# EAGLE design sensor-example (EAGLE 9.0.0)
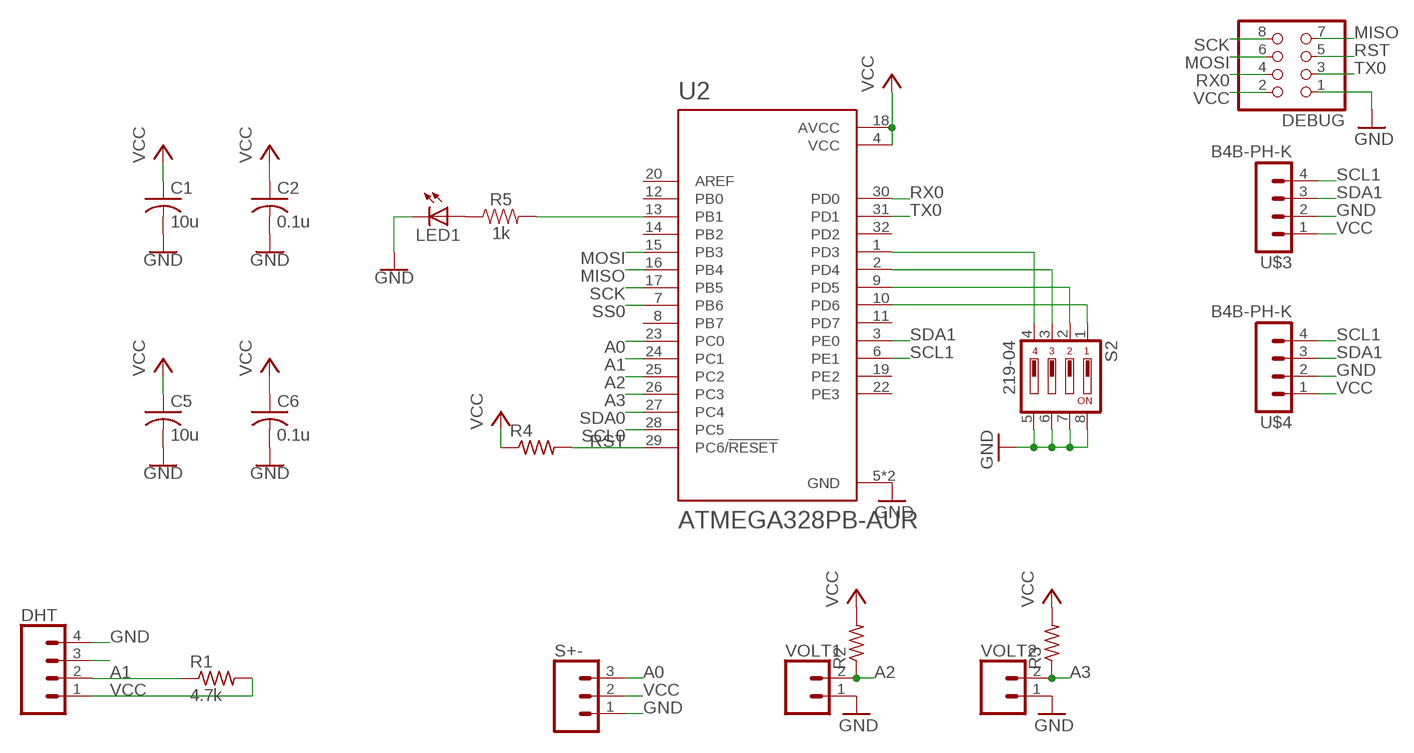
[diagram p0: schematic, sheet 1]

## Parts
C1  10u  C-USC0603  [C0603]
C2  0.1u  C-USC0603  [C0603]
C5  10u  C-USC0603  [C0603]
C6  0.1u  C-USC0603  [C0603]
DEBUG  PINHD-2X4  [2X04]
DHT  CONN_04  [1X04]
LED1  LEDSML0805  [SML0805]
R1  4.7k  R-US_R0603  [R0603]
R2  R-US_R0603  [R0603]
R3  R-US_R0603  [R0603]
R4  R-US_R0603  [R0603]
R5  1k  1KOHM-0603-1/10W-1%  [0603]
S2  219-04  [CTS-219-04]
S+-  CONN_03  [1X03]
U2  ATMEGA328PB-AUR  [QFP80P900X900X120-32N]
U$3  B4B-PH-K  [B4B-PH-K]
U$4  B4B-PH-K  [B4B-PH-K]
VOLT1  CONN_02  [1X02]
VOLT2  CONN_02  [1X02]

## Nets
A0: S+-.3 U2.23(PC0)
A1: DHT.2 R1.1 U2.24(PC1)
A2: R2.1 U2.25(PC2) VOLT1.2
A3: R3.1 U2.26(PC3) VOLT2.2
GND: C1.2 C2.2 DEBUG.1 DHT.4 LED1.C S2.5 S2.6 S2.7 S2.8 S+-.1 U2.5(GND) U2.21(GND) U$3.2 U$4.2 VOLT1.1 VOLT2.1
MISO: DEBUG.7 U2.16(PB4)
MOSI: DEBUG.6 U2.15(PB3)
N$1: S2.4 U2.1(PD3)
N$2: S2.3 U2.2(PD4)
N$3: S2.2 U2.9(PD5)
N$4: S2.1 U2.10(PD6)
N$6: DHT.3
N$12: LED1.A R5.1
N$13: R5.2 U2.13(PB1)
RST: DEBUG.5 R4.2 U2.29(PC6/!RESET)
RX0: DEBUG.4 U2.30(PD0)
SCK: DEBUG.8 U2.17(PB5)
SCL0: U2.28(PC5)
SCL1: U2.6(PE1) U$3.4 U$4.4
SDA0: U2.27(PC4)
SDA1: U2.3(PE0) U$3.3 U$4.3
SS0: U2.7(PB6)
TX0: DEBUG.3 U2.31(PD1)
VCC: C1.1 C2.1 C5.1 C6.1 DEBUG.2 DHT.1 R1.2 R2.2 R3.2 R4.1 S+-.2 U2.4(VCC) U2.18(AVCC) U$3.1 U$4.1
Unconnected: C5.2 C6.2 U2.8(PB7) U2.11(PD7) U2.12(PB0) U2.14(PB2) U2.19(PE2) U2.20(AREF) U2.22(PE3) U2.32(PD2)

## Library data of the parts
C1 C2 C5 C6 = resistor:C-US: CAPACITOR, American symbol
DEBUG = pinhead:PINHD-2X4: PIN HEADER
DHT = SparkFun-Connectors:CONN_04: Multi connection point. Often used as Generic Header-pin footprint for 0.1 inch spaced/style header connections On any of the 0.1 inch spaced packages, you can populate with these: Break Away Headers - Straight <https://www.sparkfun.com/products/116> (PRT-00116) Break Away Male Headers - Right Angle <https://www.sparkfun.com/products/553> (PRT-00553) Female Headers <https://www.sparkfun.com/products/115> (PRT-00115) Break Away Headers - Machine Pin <https://www.sparkfun.com/products/117> (PRT-00117) Break Away Female Headers - Swiss Machine Pin <https://www.sparkfun.com/products/743> (PRT-00743) For SCREWTERMINALS and SPRING TERMINALS visit here: Screw Terimnals on SparkFun.com <https://www.sparkfun.com/search/results?term=Screw+Terminals> (5mm/3.5mm/2.54mm spacing) This device is also useful as a general connection point to wire up your design to another part of your project. Our various solder wires solder well into these plated through hole pads. Hook-Up Wire - Assortment (Stranded, 22 AWG) <https://www.sparkfun.com/products/11375> (PRT-11375) Hook-Up Wire - Assortment (Solid Core, 22 AWG) <https://www.sparkfun.com/products/11367> (PRT-11367) View the entire wire category on our website here <https://www.sparkfun.com/categories/141> Special notes: Molex polarized connector foot print use with SKU : PRT-08231 with associated crimp pins and housings. 1MM SMD Version SKU: PRT-10208; PROD_ID: CONN-09696
LED1 = led:LED: LED OSRAM: - CHIPLED LG R971, LG N971, LY N971, LG Q971, LY Q971, LO R971, LY R971 LH N974, LH R974 LS Q976, LO Q976, LY Q976 LO Q996 - Hyper CHIPLED LW Q18S LB Q993, LB Q99A, LB R99A - SideLED LS A670, LO A670, LY A670, LG A670, LP A670 LB A673, LV A673, LT A673, LW A673 LH A674 LY A675 LS A676, LA A676, LO A676, LY A676, LW A676 LS A679, LY A679, LG A679 - Hyper Micro SIDELED® LS Y876, LA Y876, LO Y876, LY Y876 LT Y87S - SmartLED LW L88C, LW L88S LB L89C, LB L89S, LG L890 LS L89K, LO L89K, LY L89K LS L896, LA L896, LO L896, LY L896 - TOPLED LS T670, LO T670, LY T670, LG T670, LP T670 LSG T670, LSP T670, LSY T670, LOP T670, LYG T670 LG T671, LOG T671, LSG T671 LB T673, LV T673, LT T673, LW T673 LH T674 LS T676, LA T676, LO T676, LY T676, LB T676, LH T676, LSB T676, LW T676 LB T67C, LV T67C, LT T67C, LS T67K, LO T67K, LY T67K, LW E67C LS E67B, LA E67B, LO E67B, LY E67B, LB E67C, LV E67C, LT E67C LW T67C LS T679, LY T679, LG T679 LS T770, LO T770, LY T770, LG T770, LP T770 LB T773, LV T773, LT T773, LW T773 LH T774 LS E675, LA E675, LY E675, LS T675 LS T776, LA T776, LO T776, LY T776, LB T776 LHGB T686 LT T68C, LB T68C - Hyper Mini TOPLED® LB M676 - Mini TOPLED Santana® LG M470 LS M47K, LO M47K, LY M47K Source: http://www.osram.convergy.de LUXEON: - LUMILED® LXK2-PW12-R00, LXK2-PW12-S00, LXK2-PW14-U00, LXK2-PW14-V00 LXK2-PM12-R00, LXK2-PM12-S00, LXK2-PM14-U00 LXK2-PE12-Q00, LXK2-PE12-R00, LXK2-PE12-S00, LXK2-PE14-T00, LXK2-PE14-U00 LXK2-PB12-K00, LXK2-PB12-L00, LXK2-PB12-M00, LXK2-PB14-N00, LXK2-PB14-P00, LXK2-PB14-Q00 LXK2-PR12-L00, LXK2-PR12-M00, LXK2-PR14-Q00, LXK2-PR14-R00 LXK2-PD12-Q00, LXK2-PD12-R00, LXK2-PD12-S00 LXK2-PH12-R00, LXK2-PH12-S00 LXK2-PL12-P00, LXK2-PL12-Q00, LXK2-PL12-R00 Source: www.luxeon.com KINGBRIGHT: KA-3528ASYC Source: www.kingbright.com
R1-R4 = resistor:R-US_: RESISTOR, American symbol
R5 = SparkFun-Resistors:1KOHM: 1kΩ resistor A resistor is a passive two-terminal electrical component that implements electrical resistance as a circuit element. Resistors act to reduce current flow, and, at the same time, act to lower voltage levels within circuits. - Wikipedia; PROD_ID: RES-07856
S2 = switch-dil:219-04*: Surface Mount DIP Switch Series 219 SMT CTS Electronic Components Sourc: www.ctscorp.com; OC_FARNELL: unknown; OC_NEWARK: unknown
S+- = SparkFun-Connectors:CONN_03: Multi connection point. Often used as Generic Header-pin footprint for 0.1 inch spaced/style header connections On any of the 0.1 inch spaced packages, you can populate with these: Break Away Headers - Straight <https://www.sparkfun.com/products/116> (PRT-00116) Break Away Male Headers - Right Angle <https://www.sparkfun.com/products/553> (PRT-00553) Female Headers <https://www.sparkfun.com/products/115> (PRT-00115) Break Away Headers - Machine Pin <https://www.sparkfun.com/products/117> (PRT-00117) Break Away Female Headers - Swiss Machine Pin <https://www.sparkfun.com/products/743> (PRT-00743) Stackable Header - 3 Pin (Female, 0.1") <https://www.sparkfun.com/products/13875> (PRT-13875) For SCREWTERMINALS and SPRING TERMINALS visit here: Screw Terimnals on SparkFun.com <https://www.sparkfun.com/search/results?term=Screw+Terminals> (5mm/3.5mm/2.54mm spacing) This device is also useful as a general connection point to wire up your design to another part of your project. Our various solder wires solder well into these plated through hole pads. Hook-Up Wire - Assortment (Stranded, 22 AWG) <https://www.sparkfun.com/products/11375> (PRT-11375) Hook-Up Wire - Assortment (Solid Core, 22 AWG) <https://www.sparkfun.com/products/11367> (PRT-11367) View the entire wire category on our website here <https://www.sparkfun.com/categories/141> Special notes: Molex polarized connector foot print use with SKU : PRT-08232 with associated crimp pins and housings.; PROD_ID: XXX-00000; VALUE: 455-1750-1-ND
U2 = ATMEGA328PB-AUR:ATMEGA328PB-AUR: ATmega Series 20 MHz 32 KB Flash 2 KB SRAM 8-Bit Microcontroller - TQFP-32; DESCRIPTION: AVR microcontroller; EEPROM: 1024B; SRAM: 2kB; Flash: 32kB; TQFP32; DIGI-KEY_PART_NUMBER: ATMEGA328PB-AURCT-ND; DIGI-KEY_PURCHASE_URL: https://www.digikey.com/product-detail/en/microchip-technology/ATMEGA328PB-AUR/ATMEGA328PB-AURCT-ND/5722706?WT.z_cid=ref_snapeda&utm_source=snapeda&utm_medium=aggregator&utm_campaign=buynow; MF: Microchip; MP: ATMEGA328PB-AUR; PACKAGE: TQFP-32 Microchip
U$3 U$4 = con-jst-ph:B4B-PH-K: HEADER
VOLT1 VOLT2 = SparkFun-Connectors:CONN_02: Multi connection point. Often used as Generic Header-pin footprint for 0.1 inch spaced/style header connections On any of the 0.1 inch spaced packages, you can populate with these: Break Away Headers - Straight <https://www.sparkfun.com/products/116> (PRT-00116) Break Away Male Headers - Right Angle <https://www.sparkfun.com/products/553> (PRT-00553) Female Headers <https://www.sparkfun.com/products/115> (PRT-00115) Break Away Headers - Machine Pin <https://www.sparkfun.com/products/117> (PRT-00117) Break Away Female Headers - Swiss Machine Pin <https://www.sparkfun.com/products/743> (PRT-00743) For SCREWTERMINALS and SPRING TERMINALS visit here: Screw Terimnals on SparkFun.com <https://www.sparkfun.com/search/results?term=Screw+Terminals> (5mm/3.5mm/2.54mm spacing) This device is also useful as a general connection point to wire up your design to another part of your project. Our various solder wires solder well into these plated through hole pads. Hook-Up Wire - Assortment (Stranded, 22 AWG) <https://www.sparkfun.com/products/11375> (PRT-11375) Hook-Up Wire - Assortment (Solid Core, 22 AWG) <https://www.sparkfun.com/products/11367> (PRT-11367) View the entire wire category on our website here <https://www.sparkfun.com/categories/141> Special notes: Molex polarized connector foot print use with: PRT-08233 with associated crimp pins and housings. 2.54_SCREWTERM for use with PRT-10571. 3.5mm Screw Terminal footprints for PRT-08084 5mm Screw Terminal footprints for use with PRT-08432

## Module 2
Ports: 

### Library data of the parts

## Board
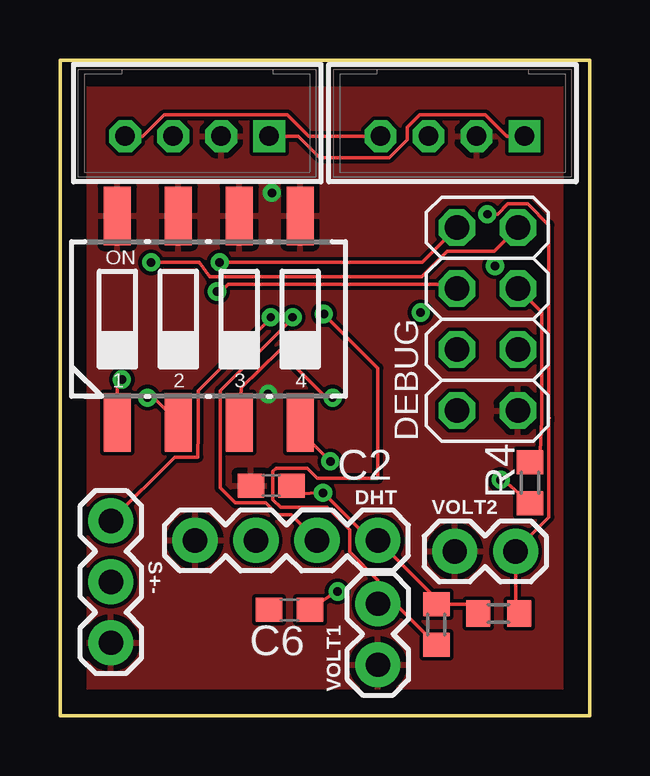
[diagram p1: board, top side]
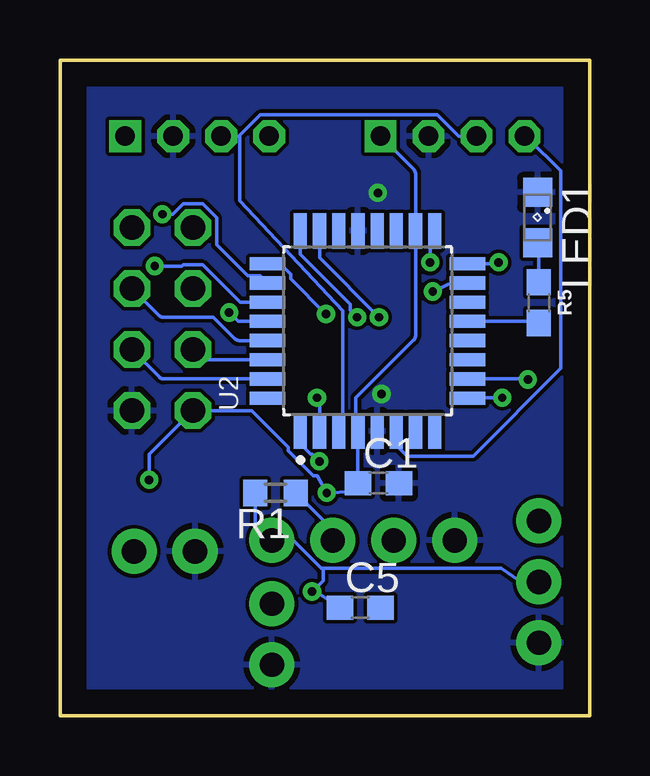
[diagram p2: board, bottom side, seen from below]

Size 22.07 x 27.33 mm. Coordinates in mm from the lower left corner, seen from the top.
Outline: 0,0 0,27.33 22.07,27.33 22.07,0 0,0
Copper layers (1*16): Top 0.035mm / dielectric 1.5mm / Bottom 0.035mm
Design rules "default": minimum track width 6mil, minimum drill 0.35mm, track to track 6mil, track to pad 6mil, pad to pad 6mil, via to via 6mil, smd to smd 6mil, copper to edge 40mil, drill to drill 6mil, minimum pad ring 10mil, minimum via ring 8mil, stop-mask expansion 4mil, vias tented up to drill 0mil, thermal gap 10mil

### Footprints (pad centres in the part's own frame; a part is rotated, then mirrored left to right if it is on the bottom)
C0603 = smd 1.1 x 1: 1 -0.85,0; 2 0.85,0
2X04 = drill 1.016 octagon: 1 -3.81,-1.27; 2 -3.81,1.27; 3 -1.27,-1.27; 4 -1.27,1.27; 5 1.27,-1.27; 6 1.27,1.27; 7 3.81,-1.27; 8 3.81,1.27
1X04 = drill 1.016 pad 1.88: 1 0,0; 2 2.54,0; 3 5.08,0; 4 7.62,0
SML0805 = smd 1.2 x 1.2: A 1.05,0; C -1.05,0
R0603 = smd 1 x 1.1: 1 -0.85,0; 2 0.85,0
0603 = smd 1.1 x 1: 1 -0.85,0; 2 0.85,0
CTS-219-04 = smd 1.13 x 2.44: 1 -3.81,-4.3; 2 -1.27,-4.3; 3 1.27,-4.3; 4 3.81,-4.3; 5 3.81,4.3; 6 1.27,4.3; 7 -1.27,4.3; 8 -3.81,4.3
1X03 = drill 1.016 pad 1.88: 1 0,0; 2 2.54,0; 3 5.08,0
QFP80P900X900X120-32N = smd 1.47 x 0.55: 1 -4.17,2.8; 2 -4.17,2; 3 -4.17,1.2; 4 -4.17,0.4; 5 -4.17,-0.4; 6 -4.17,-1.2; 7 -4.17,-2; 8 -4.17,-2.8; 17 4.17,-2.8; 18 4.17,-2; 19 4.17,-1.2; 20 4.17,-0.4; 21 4.17,0.4; 22 4.17,1.2; 23 4.17,2; 24 4.17,2.8 | smd 0.55 x 1.47: 9 -2.8,-4.17; 10 -2,-4.17; 11 -1.2,-4.17; 12 -0.4,-4.17; 13 0.4,-4.17; 14 1.2,-4.17; 15 2,-4.17; 16 2.8,-4.17; 25 2.8,4.17; 26 2,4.17; 27 1.2,4.17; 28 0.4,4.17; 29 -0.4,4.17; 30 -1.2,4.17; 31 -2,4.17; 32 -2.8,4.17
B4B-PH-K = drill 0.813 square: 1 -3,0 | drill 0.813 octagon: 2 -1,0; 3 1,0; 4 3,0
1X02 = drill 1.016 pad 1.88: 1 0,0; 2 2.54,0

### Placement (x,y rotation side)
C1  8.8,9.69 0 bottom
C2  8.8,9.6 180 top
C5  9.56,4.51 0 bottom
C6  9.56,4.42 180 top
DEBUG  17.81,16.54 90 top
DHT  13.25,7.32 180 top
LED1  2.17,20.76 270 bottom
R1  13.09,9.3 180 bottom
R2  15.68,3.81 90 top
R3  18.28,4.27 180 top
R4  19.58,9.72 90 top
R5  2.12,17.22 270 bottom
S2  6.2,16.54 0 top
S+-  2.12,3.05 90 top
U2  9.26,16.04 90 bottom
U$3  16.36,24.16 180 top
U$4  5.71,24.16 180 top
VOLT1  13.25,2.13 90 top
VOLT2  16.45,6.86 0 top

### Tracks (layer width: path | path; a pad name or v marks a point on that pad's centre or on a via)
A0  (via drill 0.35)
  Top 0.152: S+-.3 4.78,10.79 5.74,10.79 5.76,11.87 5.76,13.55 8.78,16.57 v8.78,16.61
  Bottom 0.152: U2.23 11.26,19.09 v8.78,16.61
A1  (via drill 0.35)
  Top 0.152: v9.69,16.61 9.69,16.57 6.67,13.55 6.67,9.51 7.31,8.87 8.58,8.87 9.06,8.38 9.64,8.38 DHT.2
  Bottom 0.152: v9.69,16.61 9.99,16.91 9.99,17.16 12.06,19.23 U2.24 | R1.1 10.71,7.76 DHT.2
A2  (via drill 0.35)
  Top 0.152: v10.99,16.74 13.25,14.49 13.25,9.9 10.72,9.9 10.3,10.33 9.01,10.33 8.87,10.2 8.87,9.01 9.19,8.69 11.14,8.69 12.08,7.75 12.08,6.83 13.25,5.66 VOLT1.2 13.97,4.67 R2.1
  Bottom 0.152: U2.25 13.44,18.85 12.91,18.85 12.47,18.41 12.47,18.22 v10.99,16.74
A3  (via drill 0.35)
  Top 0.152: R3.1 18.99,4.71 VOLT2.2 18.99,6.9 20.37,8.28 20.37,12.31 20.38,12.43 20.37,12.43 20.37,20.45 19.49,21.34 18.67,21.34 18.23,20.9 v17.81,20.9
  Bottom 0.152: U2.26 13.73,18.34 14.26,18.34 15.55,19.62 15.55,20.76 16.13,21.34 16.95,21.34 17.38,20.9 v17.81,20.9
GND  (via drill 0.35)
  other vias: 8.83,21.79 8.67,13.41
  pour Top: 30.01,31.14 30.01,-5.69 -6.82,-5.69 -6.82,31.14
  pour Bottom: 27.47,29.87 27.47,-4.42 -4.28,-4.42 -4.28,29.87
MISO  (via drill 0.35)
  Top 0.152: DEBUG.7 18.09,19.35 16.13,19.35 15.06,18.29 6.25,18.29 5.79,18.9 v3.8,18.9
  Bottom 0.152: U2.16 3.86,18.84 v3.8,18.9
MOSI  (via drill 0.35)
  Top 0.152: v6.54,17.68 6.7,17.68 7,17.99 16.36,17.99 DEBUG.6
  Bottom 0.152: U2.15 5.9,17.99 v6.54,17.68
N$1  (via drill 0.35)
  Top 0.152: v11.27,10.6 10.01,11.86 S2.4
  Bottom 0.152: v11.27,10.6 11.57,10.91 11.63,10.91 12.06,11.34 U2.1
N$2  (via drill 0.35)
  Top 0.152: v11.36,13.26 11.09,13.26 9.14,15.21 7.54,13.68 S2.3
  Bottom 0.152: U2.2 11.26,13.16 v11.36,13.26
N$3  (via drill 0.35)
  Top 0.152: S2.2 3.9,13.26 v3.65,13.26
  Bottom 0.152: v3.65,13.26 5.07,13.26 U2.9
N$4  (via drill 0.35)
  Top 0.152: v2.58,14.02 2.39,13.83 S2.1
  Bottom 0.152: U2.10 2.6,14.04 v2.58,14.02
N$12
  Bottom 0.152: R5.1 2.12,19.66 LED1.A
N$13
  Bottom 0.152: U2.13 2.19,16.44 R5.2
RST
  Top 0.152: R4.2 20,11.03 20.07,12.32 20.07,16.81 DEBUG.5
  Bottom 0.152: U2.29 14.61,15.64 arc45 14.79,15.71 15.68,16.61 17.78,16.61 arc45 17.96,16.69 DEBUG.5
RX0
  Bottom 0.152: U2.30 16.01,14.84 arc45 16.18,14.91 DEBUG.4
SCK  (via drill 0.35)
  Top 0.152: v6.65,18.9 15.09,18.9 DEBUG.8
  Bottom 0.152: U2.17 6.65,20.02 v6.65,18.9
SCL0  (via drill 0.35)
  Bottom 0.152: U2.28 14.66,16.44 v15.03,16.81
SCL1
  Top 0.152: U$4.4 3.46,24.16 4.35,25.04 9.47,25.04 10.36,24.16 U$3.4
  Bottom 0.152: U2.6 7.91,11.73 7.91,11.13 7.61,10.82 4.86,10.82 1.21,14.48 1.21,22.71 2.58,24.08 U$4.4
SDA0  (via drill 0.35)
  Bottom 0.152: U2.27 14.57,17.24 16.13,18.8 16.95,18.8 17,18.75 v18.12,18.75
SDA1
  Bottom 0.152: U$4.3 5.46,24.16 6.35,25.04 13.73,25.04 14.58,24.19 | U$3.3 14.62,24.16 14.58,24.19 | U2.3 10.3,12.17 10.3,16.89 14.58,21.48 14.58,24.19
TX0
  Bottom 0.152: U2.31 17.75,14.04 arc45 17.92,14.11 DEBUG.3
VCC  (via drill 0.35)
  Top 0.152: U$4.1 9.93,24.16 10.82,23.27 13.73,23.27 14.47,24.01 14.47,24.52 14.99,25.04 17.73,25.04 18.62,24.16 U$3.1 | C2.1 9.82,9.43 arc-45 9.89,9.25 v10.96,9.3 12.94,7.32 DHT.1 15.68,4.88 R2.2 17.03,4.66 R3.2 | R4.1 18.46,9.84 v18.36,9.84 | C6.1 11.48,5.18 v11.57,5.18
  Bottom 0.152: U2.4 9.66,11.73 | 9.66,11.73 9.66,9.71 arc-45 C1.1 9.82,9.52 arc-45 9.89,9.34 v10.96,9.3 11.36,10 11.52,10 12.56,11.04 12.56,11.2 14.08,12.73 DEBUG.2 18.36,10.9 v18.36,9.84 | U$4.1 7.33,22.77 arc45 7.26,22.59 U2.18 7.26,15.85 arc45 7.33,15.67 9.74,13.26 9.74,11.92 arc-45 9.67,11.74 9.66,11.73 | R1.2 13.94,8.01 DHT.1 12.36,7.32 11.19,6.15 11.11,6.15 | 11.11,6.15 3.7,6.15 2.73,5.49 2.32,5.59 S+-.2 | C5.1 11.39,5.18 v11.57,5.18 11.11,5.64 11.11,6.15